# EAGLE design breakout (EAGLE 6.2)
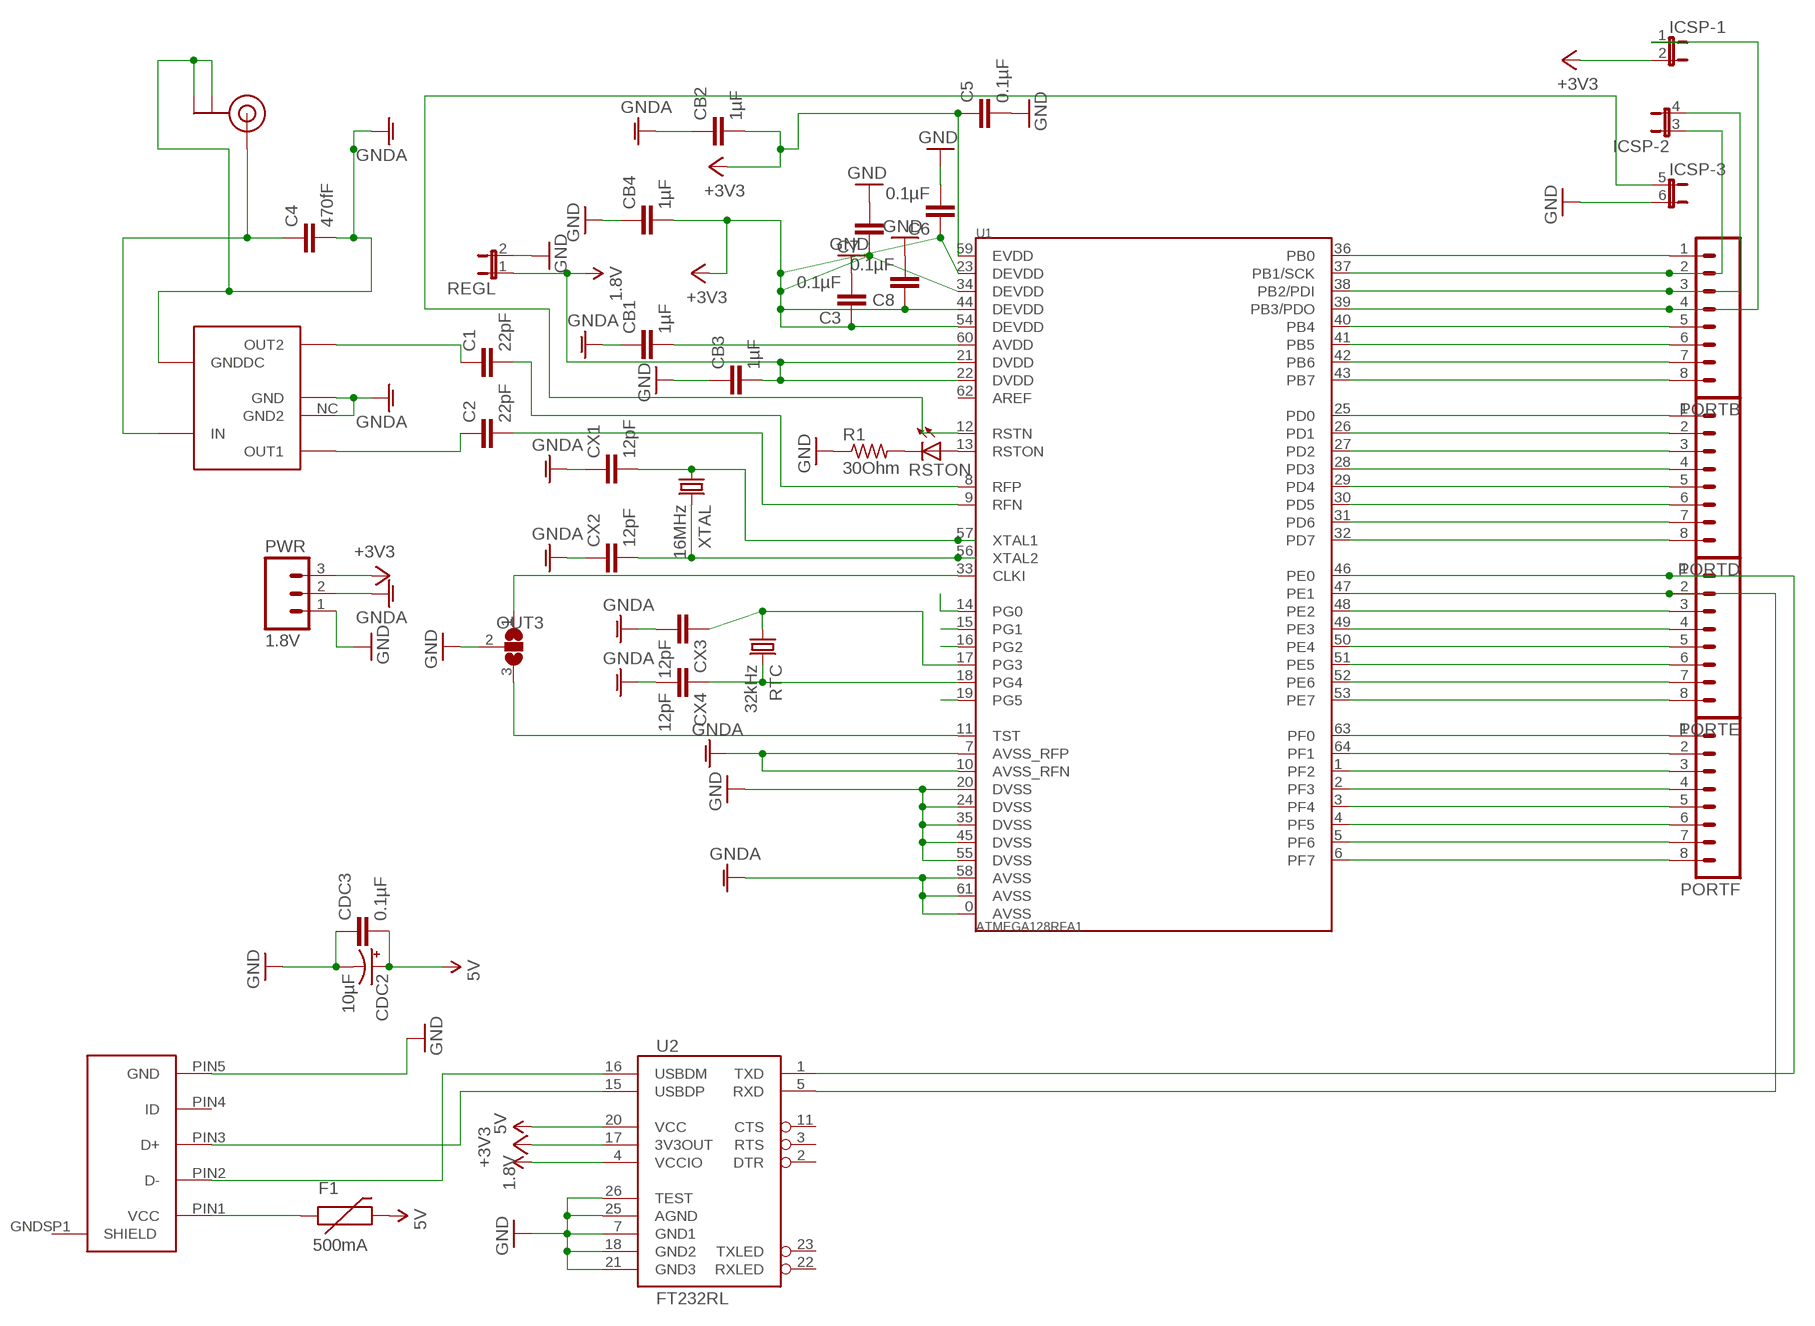
[diagram p0: schematic, sheet 1]

## Parts
B1  2.4GHz  WE-BAL  [WE-BAL]
C1  22pF  C-EUC0603  [C0603]
C2  22pF  C-EUC0603  [C0603]
C3  0.1µF  C-EUC0201  [C0201]
C4  470fF  C-EUC0402  [C0402]
C5  0.1µF  C-EUC0201  [C0201]
C6  0.1µF  C-EUC0201  [C0201]
C7  C-EUC0201  [C0201]
C8  0.1µF  C-EUC0201  [C0201]
CB1  1µF  C-EUC0603  [C0603]
CB2  1µF  C-EUC0603  [C0603]
CB3  1µF  C-EUC0603  [C0603]
CB4  1µF  C-EUC0603  [C0603]
CDC2  10µF  CAP_POL1206  [EIA3216]
CDC3  0.1µF  C-EUC0201  [C0201]
CX1  12pF  C-EUC0603  [C0603]
CX2  12pF  C-EUC0603  [C0603]
CX3  12pF  C-EUC0603  [C0603]
CX4  12pF  C-EUC0603  [C0603]
F1  500mA  PTC0603  [0603]
ICSP  JP3QE  [JP3Q]
JP1  USBMICROB  [MICROB]
OUT3  SOLDERJUMPERNO  SJ2W  [SJ_2]
PORTB  M081X08  [1X08]
PORTD  M081X08  [1X08]
PORTE  M081X08  [1X08]
PORTF  M081X08  [1X08]
PWR  1.8V  M03PTH  [1X03]
R1  30Ohm  R-US_R0603  [R0603]
REGL  JP1E  [JP1]
RSTON  LEDCHIPLED_0603  [CHIPLED_0603]
RTC  32kHz  CRYSTALTC26H  [TC26H]
U1  ATMEGA128RFA1  [QFN-64]
U2  FT232RL  FT232RL-BASICSSOP  [SSOP28DB]
U$6  U.FL  [U.FL]
XTAL  16MHz  CRYSTALHC49UP  [HC49UP]

## Nets
1.8V: CB3.2 REGL.1 U1.21(DVDD) U1.22(DVDD) U2.4(VCCIO)
5V: CDC2.A(+) CDC3.2 F1.2 U2.20(VCC)
+3V3: C3.1 C5.1 C6.1 C7.1 C8.1 CB2.2 CB4.2 ICSP.2 PWR.3 U1.23(DEVDD) U1.34(DEVDD) U1.44(DEVDD) U1.54(DEVDD) U1.59(EVDD) U2.17(3V3OUT)
GND: C3.2 C5.2 C6.2 C7.2 C8.2 CB3.1 CB4.1 CDC2.C(-) CDC3.1 ICSP.6 JP1.PIN5(GND) OUT3.2 PWR.1 R1.1 REGL.2 U1.20(DVSS) U1.24(DVSS) U1.35(DVSS) U1.45(DVSS) U1.55(DVSS) U2.7(GND1) U2.18(GND2) U2.21(GND3) U2.25(AGND) U2.26(TEST)
GNDA: B1.GND B1.GNDDC B1.NC(GND2) C4.2 CB1.1 CB2.1 CX1.1 CX2.1 CX3.2 CX4.2 PWR.2 U1.0(AVSS) U1.7(AVSS_RFP) U1.10(AVSS_RFN) U1.58(AVSS) U1.61(AVSS) U$6.P$1(GND) U$6.P$2(GND)
N$1: CX3.1 RTC.1 U1.17(PG3)
N$2: CX4.1 RTC.2 U1.18(PG4)
N$3: ICSP.1 PORTB.4 U1.39(PB3/PDO)
N$4: CB1.2 U1.60(AVDD)
N$5: B1.OUT1 C2.1
N$6: ICSP.3 PORTB.2 U1.37(PB1/SCK)
N$7: OUT3.1 U1.33(CLKI)
N$8: PORTD.1 U1.25(PD0)
N$9: C2.2 U1.9(RFN)
N$10: CX2.2 U1.56(XTAL2) XTAL.2
N$11: PORTD.2 U1.26(PD1)
N$12: ICSP.5 U1.12(RSTN)
N$13: CX1.2 U1.57(XTAL1) XTAL.1
N$14: C1.2 U1.8(RFP)
N$15: B1.OUT2 C1.1
N$17: U1.14(PG0)
N$18: PORTD.3 U1.27(PD2)
N$19: PORTD.4 U1.28(PD3)
N$20: JP1.PIN3(D+) U2.15(USBDP)
N$21: PORTD.5 U1.29(PD4)
N$22: PORTD.6 U1.30(PD5)
N$23: PORTD.7 U1.31(PD6)
N$24: PORTD.8 U1.32(PD7)
N$25: PORTE.1 U1.46(PE0) U2.1(TXD)
N$26: PORTE.2 U1.47(PE1) U2.5(RXD)
N$27: PORTE.3 U1.48(PE2)
N$28: PORTE.4 U1.49(PE3)
N$29: PORTE.5 U1.50(PE4)
N$30: PORTE.6 U1.51(PE5)
N$31: PORTE.7 U1.52(PE6)
N$32: PORTE.8 U1.53(PE7)
N$33: PORTF.1 U1.63(PF0)
N$34: PORTF.2 U1.64(PF1)
N$35: PORTF.3 U1.1(PF2)
N$36: PORTF.4 U1.2(PF3)
N$37: U1.15(PG1)
N$38: U1.16(PG2)
N$39: U1.19(PG5)
N$41: PORTB.1 U1.36(PB0)
N$42: PORTB.5 U1.40(PB4)
N$43: PORTB.6 U1.41(PB5)
N$44: PORTB.7 U1.42(PB6)
N$45: PORTB.8 U1.43(PB7)
N$46: OUT3.3 U1.11(TST)
N$47: JP1.PIN2(D-) U2.16(USBDM)
N$48: F1.1 JP1.PIN1(VCC)
N$50: RSTON.A U1.13(RSTON)
N$51: R1.2 RSTON.C
N$55: ICSP.4 PORTB.3 U1.38(PB2/PDI)
SMA: B1.IN C4.1 U$6.P$3(SIGNAL)
TCK: PORTF.5 U1.3(PF4)
TDI: PORTF.8 U1.6(PF7)
TDO: PORTF.7 U1.5(PF6)
TMS: PORTF.6 U1.4(PF5)
Unconnected: JP1.GNDSP1(SHIELD) JP1.PIN4(ID) U1.62(AREF) U2.2(DTR) U2.3(RTS) U2.11(CTS) U2.22(RXLED) U2.23(TXLED)

## Library data of the parts
B1 = matt-custom:WE-BAL
C1-C8 CB1-CB4 CDC3 CX1-CX4 = rcl:C-EU: CAPACITOR, European symbol
CDC2 = SparkFun:CAP_POL: Capacitor Polarized These are standard SMD and PTH capacitors. Normally 10uF, 47uF, and 100uF in electrolytic and tantalum varieties. Always verify the external diameter of the through hole cap, it varies with capacity, voltage, and manufacturer. The EIA devices should be standard.
F1 = SparkFun:PTC: Resettable Fuse PTC Resettable Fuse. Spark Fun Electronics SKU : COM-08357
ICSP = jumper:JP3QE: JUMPER
JP1 = matt-custom:USBMICROB
OUT3 = jumper:SJ2W: SMD solder JUMPER
PORTB PORTD PORTE PORTF = SparkFun:M08: Header 8 Standard 8-pin 0.1" header. Use with straight break away headers (SKU : PRT-00116), right angle break away headers (PRT-00553), swiss pins (PRT-00743), machine pins (PRT-00117), and female headers (PRT-00115).
PWR = SparkFun:M03: Header 3 Standard 3-pin 0.1" header. Use with straight break away headers (SKU : PRT-00116), right angle break away headers (PRT-00553), swiss pins (PRT-00743), machine pins (PRT-00117), and female headers (PRT-00115). Molex polarized connector foot print use with SKU : PRT-08232 with associated crimp pins and housings.
R1 = rcl:R-US_: RESISTOR, American symbol
REGL = jumper:JP1E: JUMPER
RSTON = led:LED: LED OSRAM: - CHIPLED LG R971, LG N971, LY N971, LG Q971, LY Q971, LO R971, LY R971 LH N974, LH R974 LS Q976, LO Q976, LY Q976 LO Q996 - Hyper CHIPLED LW Q18S LB Q993, LB Q99A, LB R99A - SideLED LS A670, LO A670, LY A670, LG A670, LP A670 LB A673, LV A673, LT A673, LW A673 LH A674 LY A675 LS A676, LA A676, LO A676, LY A676, LW A676 LS A679, LY A679, LG A679 - Hyper Micro SIDELED® LS Y876, LA Y876, LO Y876, LY Y876 LT Y87S - SmartLED LW L88C, LW L88S LB L89C, LB L89S, LG L890 LS L89K, LO L89K, LY L89K LS L896, LA L896, LO L896, LY L896 - TOPLED LS T670, LO T670, LY T670, LG T670, LP T670 LSG T670, LSP T670, LSY T670, LOP T670, LYG T670 LG T671, LOG T671, LSG T671 LB T673, LV T673, LT T673, LW T673 LH T674 LS T676, LA T676, LO T676, LY T676, LB T676, LH T676, LSB T676, LW T676 LB T67C, LV T67C, LT T67C, LS T67K, LO T67K, LY T67K, LW E67C LS E67B, LA E67B, LO E67B, LY E67B, LB E67C, LV E67C, LT E67C LW T67C LS T679, LY T679, LG T679 LS T770, LO T770, LY T770, LG T770, LP T770 LB T773, LV T773, LT T773, LW T773 LH T774 LS E675, LA E675, LY E675, LS T675 LS T776, LA T776, LO T776, LY T776, LB T776 LHGB T686 LT T68C, LB T68C - Hyper Mini TOPLED® LB M676 - Mini TOPLED Santana® LG M470 LS M47K, LO M47K, LY M47K Source: http://www.osram.convergy.de LUXEON: - LUMILED® LXK2-PW12-R00, LXK2-PW12-S00, LXK2-PW14-U00, LXK2-PW14-V00 LXK2-PM12-R00, LXK2-PM12-S00, LXK2-PM14-U00 LXK2-PE12-Q00, LXK2-PE12-R00, LXK2-PE12-S00, LXK2-PE14-T00, LXK2-PE14-U00 LXK2-PB12-K00, LXK2-PB12-L00, LXK2-PB12-M00, LXK2-PB14-N00, LXK2-PB14-P00, LXK2-PB14-Q00 LXK2-PR12-L00, LXK2-PR12-M00, LXK2-PR14-Q00, LXK2-PR14-R00 LXK2-PD12-Q00, LXK2-PD12-R00, LXK2-PD12-S00 LXK2-PH12-R00, LXK2-PH12-S00 LXK2-PL12-P00, LXK2-PL12-Q00, LXK2-PL12-R00 Source: www.luxeon.com KINGBRIGHT: KA-3528ASYC Source: www.kingbright.com
RTC XTAL = crystal:CRYSTAL: CRYSTAL; OC_FARNELL: unknown; OC_NEWARK: unknown
U1 = matt-custom:ATMEGA128RFA1
U2 = SparkFun:FT232RL-BASIC: USB UART This is the simplified version of the FT232RL unit. Only what you need, nothing you don't. Spark Fun Electronics SKU : COM-00650
U$6 = SparkFun-Connectors:U.FL: SMD antenna connector- WRL-09144

## Board
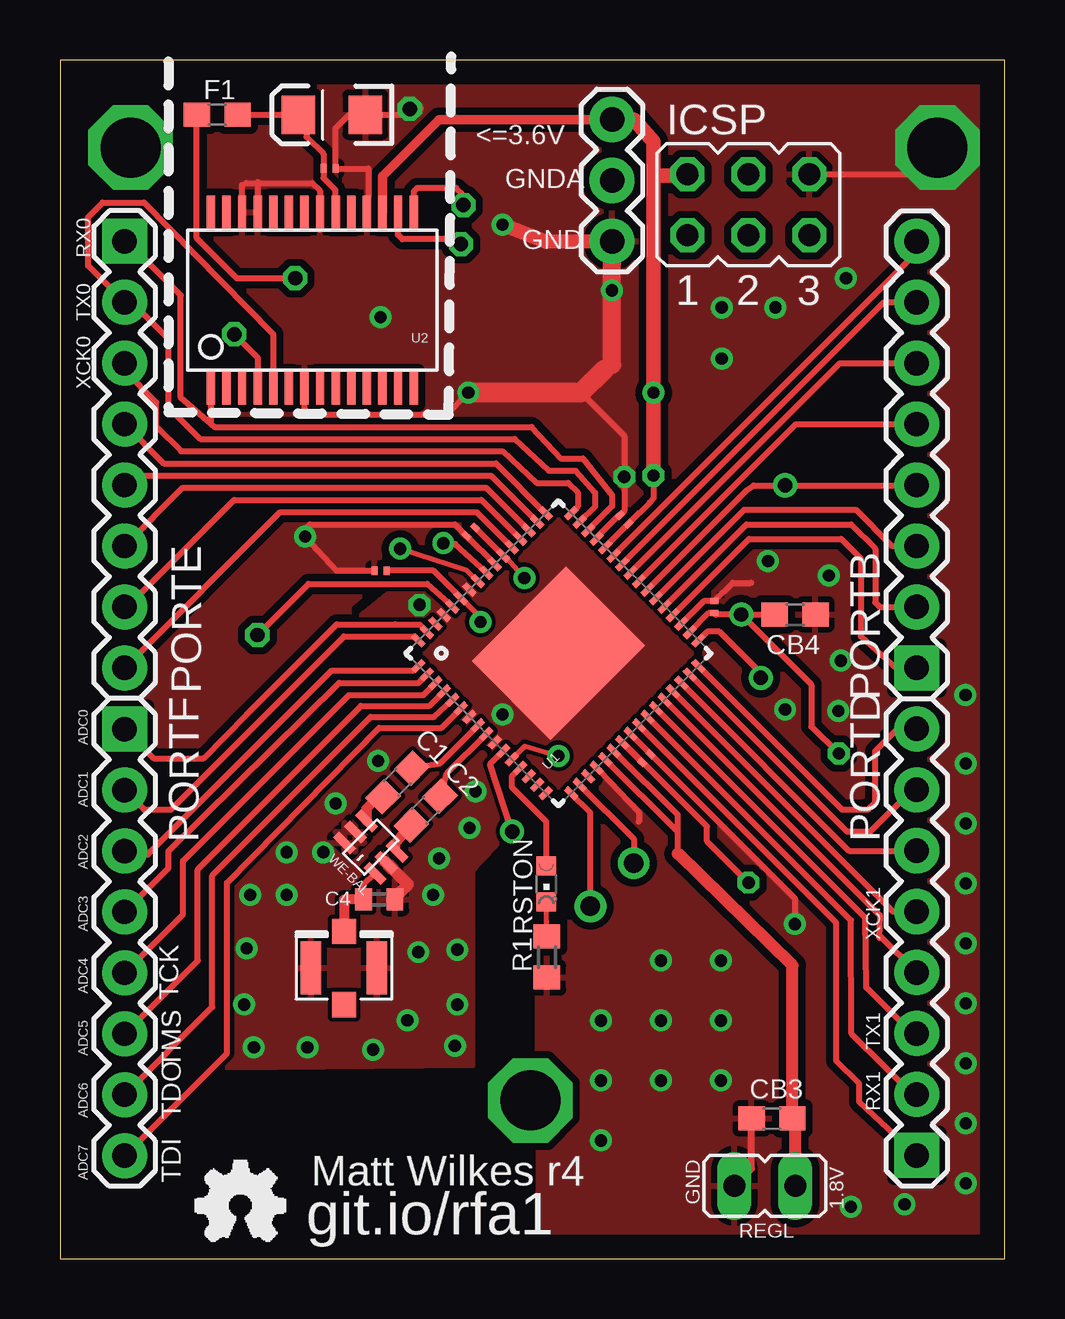
[diagram p1: board, top side]
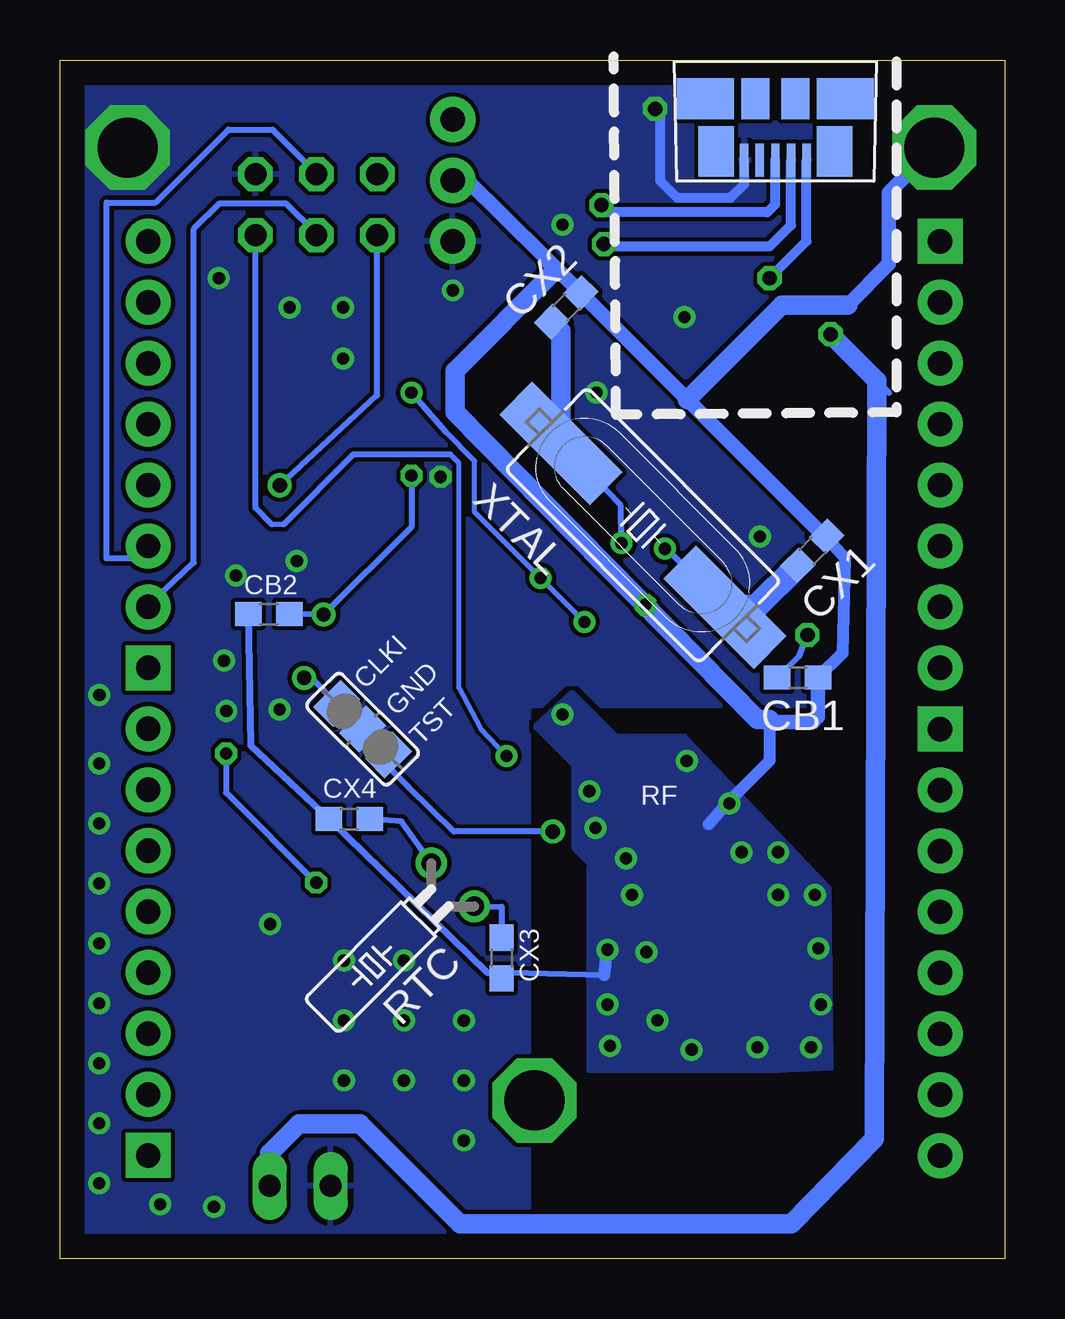
[diagram p2: board, bottom side, seen from below]

Size 39.39 x 49.98 mm. Coordinates in mm from the lower left corner, seen from the top.
Outline: 0,0 39.39,0 39.39,49.98 0,49.98 0,0
Copper layers (1*16): Top 0.035mm / dielectric 1.5mm / Bottom 0.035mm
Design rules: minimum track width 7mil, minimum drill 15mil, track to track 7mil, track to pad 8mil, pad to pad 8mil, via to via 8mil, smd to smd 8mil, copper to edge 40mil, drill to drill 10mil, minimum pad ring 10mil, minimum via ring 8mil, stop-mask expansion 0mil, vias tented up to drill 0mil, thermal gap 10mil

### Footprints (pad centres in the part's own frame; a part is rotated, then mirrored left to right if it is on the bottom)
WE-BAL = smd 1 x 0.35: GND 0.9,0; GNDDC -0.9,0; IN -0.9,0.65; NC 0.9,0.65; OUT1 -0.9,-0.65; OUT2 0.9,-0.65
C0603 = smd 1.1 x 1: 1 -0.85,0; 2 0.85,0
C0201 = smd 0.25 x 0.35: 1 -0.25,0; 2 0.25,0
C0402 = smd 0.7 x 0.9: 1 -0.65,0; 2 0.65,0
EIA3216 = smd 1.4 x 1.6: A 1.4,0; C -1.4,0
0603 = smd 1.1 x 1: 1 -0.85,0; 2 0.85,0
JP3Q = drill 0.914 octagon: 1 -2.54,-1.27; 2 -2.54,1.27; 3 0,-1.27; 4 0,1.27; 5 2.54,-1.27; 6 2.54,1.27
MICROB = smd 2.1 x 1.475: GNDFP1 3.25,1.638; GNDFP2 3.25,6.563 | smd 1.7 x 1.175: GNDSP1 1.05,3.263; GNDSP4 1.05,4.938 | smd 1.7 x 2.375: GNDSP2 1.05,7.013; GNDSP3 1.05,1.188 | smd 1.38 x 0.35: PIN1 3.61,5.4; PIN2 3.61,4.75; PIN3 3.61,4.1; PIN4 3.61,3.45; PIN5 3.61,2.8
SJ_2 = smd 1.168 x 1.6: 1 -1.524,0; 2 0,0; 3 1.524,0
1X08 = drill 1.016 pad 1.88 square: 1 0,0 | drill 1.016 pad 1.88: 2 2.54,0; 3 5.08,0; 4 7.62,0; 5 10.16,0; 6 12.7,0; 7 15.24,0; 8 17.78,0
1X03 = drill 1.016 pad 1.88: 1 0,0; 2 2.54,0; 3 5.08,0
R0603 = smd 1 x 1.1: 1 -0.85,0; 2 0.85,0
JP1 = drill 0.914 long: 1 0,-1.27; 2 0,1.27
CHIPLED_0603 = smd 0.8 x 0.8: A 0,-0.75; C 0,0.75
TC26H = drill 0.813: 1 -1.27,0; 2 1.27,0
QFN-64 = smd 5.563 x 4.648: 0 0,0 | smd 0.6 x 0.25: 1 -4.5,3.75; 2 -4.5,3.25; 3 -4.5,2.75; 4 -4.5,2.25; 5 -4.5,1.75; 6 -4.5,1.25; 7 -4.5,0.75; 8 -4.5,0.25; 9 -4.5,-0.25; 10 -4.5,-0.75; 11 -4.5,-1.25; 12 -4.5,-1.75; 13 -4.5,-2.25; 14 -4.5,-2.75; 15 -4.5,-3.25; 16 -4.5,-3.75; 33 4.5,-3.75; 34 4.5,-3.25; 35 4.5,-2.75; 36 4.5,-2.25; 37 4.5,-1.75; 38 4.5,-1.25; 39 4.5,-0.75; 40 4.5,-0.25; 41 4.5,0.25; 42 4.5,0.75; 43 4.5,1.25; 44 4.5,1.75; 45 4.5,2.25; 46 4.5,2.75; 47 4.5,3.25; 48 4.5,3.75 | smd 0.25 x 0.6: 17 -3.75,-4.5; 18 -3.25,-4.5; 19 -2.75,-4.5; 20 -2.25,-4.5; 21 -1.75,-4.5; 22 -1.25,-4.5; 23 -0.75,-4.5; 24 -0.25,-4.5; 25 0.25,-4.5; 26 0.75,-4.5; 27 1.25,-4.5; 28 1.75,-4.5; 29 2.25,-4.5; 30 2.75,-4.5; 31 3.25,-4.5; 32 3.75,-4.5; 49 3.75,4.5; 50 3.25,4.5; 51 2.75,4.5; 52 2.25,4.5; 53 1.75,4.5; 54 1.25,4.5; 55 0.75,4.5; 56 0.25,4.5; 57 -0.25,4.5; 58 -0.75,4.5; 59 -1.25,4.5; 60 -1.75,4.5; 61 -2.25,4.5; 62 -2.75,4.5; 63 -3.25,4.5; 64 -3.75,4.5
SSOP28DB = smd 0.348 x 1.397: 1 -4.225,-3.656; 2 -3.575,-3.656; 3 -2.925,-3.656; 4 -2.275,-3.656; 5 -1.625,-3.656; 6 -0.975,-3.656; 7 -0.325,-3.656; 8 0.325,-3.656; 9 0.975,-3.656; 10 1.625,-3.656; 11 2.275,-3.656; 12 2.925,-3.656; 13 3.575,-3.656; 14 4.225,-3.656; 15 4.225,3.656; 16 3.575,3.656; 17 2.925,3.656; 18 2.275,3.656; 19 1.625,3.656; 20 0.975,3.656; 21 0.325,3.656; 22 -0.325,3.656; 23 -0.975,3.656; 24 -1.625,3.656; 25 -2.275,3.656; 26 -2.925,3.656; 27 -3.575,3.656; 28 -4.225,3.656
U.FL = smd 2.2 x 0.85: P$1 0,1.375; P$2 0,-1.375 | smd 1.05 x 1: P$3 1.525,0; P$4 -1.525,0
HC49UP = smd 5.334 x 1.93: 1 -4.826,0; 2 4.826,0

### Placement (x,y rotation side)
B1  12.95,17.17 135 top
C1  14.07,19.86 45 top
C2  15.24,18.69 45 top
C3  13.36,28.69 180 top
C4  13.31,14.99 0 top
C5  24.44,20.87 45 top
C6  27.28,27.17 90 top
C7  23.52,30.82 135 top
C8  17.12,30.32 225 top
CB1  8.64,24.23 180 bottom
CB2  30.68,26.87 0 bottom
CB3  29.68,5.85 0 top
CB4  30.65,26.86 180 top
CDC2  11.33,47.69 180 top
CDC3  11.23,45.45 180 top
CX1  8.03,29.51 225 bottom
CX2  18.29,39.67 225 bottom
CX3  20.98,12.55 270 bottom
CX4  27.33,18.34 180 bottom
F1  6.56,47.69 0 top
ICSP  28.7,43.94 0 top
JP1  13.67,49.42 270 bottom
OUT3  26.77,22.09 315 bottom
PORTB  35.72,24.64 90 top
PORTD  35.72,4.32 90 top
PORTE  2.7,42.42 270 top
PORTF  2.7,22.09 270 top
PWR  23.02,42.42 90 top
R1  20.3,12.59 90 top
REGL  29.38,3.04 90 top
RSTON  20.27,15.63 180 top
RTC  23.01,15.6 135 bottom
U1  20.78,25.25 45 top
U2  10.52,39.97 0 top
U$6  11.84,12.13 90 top
XTAL  15.09,30.58 135 bottom

### Tracks (layer width: path | path; a pad name or v marks a point on that pad's centre or on a via)
1.8V  (via drill 0.6)
  Top 0.254: U2.4 8.24,37.57 v7.27,38.54 | U1.22 25.76,18.5 25.76,17.79 | 25.76,17.79 U1.21 | 25.76,16.9 25.76,17.79
  Top 0.508: 25.76,16.9 30.53,12.23 CB3.2 30.65,5.54 REGL.1
  Bottom 0.254: v7.27,38.54 4.83,36.11
  Bottom 0.813: REGL.1 30.65,4.39 29.42,5.63 26.88,5.63 22.71,1.46 8.89,1.46 5.44,5.02 5.34,36.61 v7.27,38.54
5V
  Top 0.254: U2.20 11.47,44.36 11.47,44.57 10.98,45.06 CDC3.2 10.98,46.06 10.28,46.76 10.28,47.34 CDC2.A F1.2
+3V3  (via drill 0.51, 0.6)
  Top 0.203: U1.59 17.53,26.73 v17.53,26.56 | 18.65,29.2 v19.36,28.38 19.41,28.38
  Top 0.254: U1.59 15.57,28.69 C3.1 | C8.1 U1.54 18.59,29.2 18.65,29.2 | C5.1 24.26,20.7 U1.23 23.46,21.53 26.98,18.02 26.98,17.41 v28.7,15.68 | U1.34 27.04,26.92 C6.1 27.34,26.86 v28.4,26.86 | v28.4,26.86 CB4.2 | v24.74,32.65 24.74,31.74 24.59,31.53 C7.1 U1.44 24.16,31.1 | v32.46,21.07 31.32,22.19 31.32,23.95 v28.4,26.86 | ICSP.2
  Top 0.406: U2.17 13.44,45.13 15.8,47.49 18.22,47.49 PWR.3
  Top 0.61: 24.74,45.15 v24.74,36.11 v24.74,32.65 | 24.74,45.15 24.74,46.57 24.03,47.38 23.92,47.5 PWR.3 | ICSP.2 26.1,45.15 24.74,45.15
  Bottom 0.203: v17.53,26.56 v19.36,28.38 | v19.36,28.38 19.41,28.38 | v19.36,28.38 22.1,31.13 22.1,33.26 23.32,34.49 23.33,34.48
  Bottom 0.254: CB2.2 29.71,26.87 v28.4,26.86 24.74,30.52 v24.74,32.65 | v32.46,21.07 32.46,19.44 v28.7,15.68 | 23.32,34.49 v24.74,36.11
GND  (via drill 0.51, 0.6, 2.5)
  Top 0.254: U1.20 22.49,20.37 24.13,18.63 24.13,18.22 | v36.58,46.33 35.46,45.21 ICSP.6 | 23.01,41.49 22.91,41.39 | 10.84,42.89 U2.21 10.84,44.52 10.52,44.84 8.18,44.84 | U2.26 7.59,44.76 7.78,44.84 8.18,44.84 | U2.25 8.24,44.88 8.18,44.84 | U2.7 10.19,35.42 10.42,35.19 16.11,35.19 v17.02,36.11 | 22.69,37.08 23.01,37.26 | CDC2.C 12.86,47.69 | U1.45 22.37,30.07 23.29,31 C7.2 23.52,31.18 v23.52,32.6 23.52,34.3 21.72,36.11 | C3.2 11.53,28.69 v10.21,30.11 10.21,30.42 10.42,30.62 16.47,30.62 C8.2 U1.55 | U1.35 26.83,27.42 C6.2 28.05,28.18 28.81,28.18 | C5.2 U1.24 30.64,15.04 v30.64,13.96 | U2.18 12.79,44.14 12.86,44.34 12.86,45.45 CDC3.1 | CDC2.C 12.04,47.69 11.48,47.13 CDC3.1 | CDC2.C 14.73,47.69 15,47.95 15.05,47.95 v14.58,47.94 | CDC3.1 11.48,45.41
  Top 0.3: CB3.1 28.83,3.77 REGL.2
  Top 0.61: v18.44,43.12 20.27,42.41 PWR.1
  Top 0.75: 23.01,37.26 23.01,41.49 PWR.1
  Top 0.813: v17.02,36.11 21.72,36.11 22.69,37.08
  Bottom 0.406: JP1.PIN5 10.87,44.8 11.43,44.23 13.67,44.23 14.38,44.95 14.38,47.74 v14.58,47.94
  other vias: 22.55,9.94 22.55,7.44 22.55,4.94 25.05,12.44 25.05,9.94 25.05,7.44 27.55,12.44 27.55,9.94 27.55,7.44 37.76,20.65 37.76,18.15 37.76,15.65 37.76,13.15 37.76,10.65 37.76,8.15 37.76,5.65 37.76,3.15 32.45,22.84 32.55,24.94 35.21,2.27 30.23,22.9 32.06,28.49 29.52,29.1 32.97,2.17 37.75,23.51 23.02,40.37 27.59,37.53 27.59,39.66 29.82,39.66 32.77,40.88 13.36,39.26
  pour Top (isolate 0.305, rank 5): 19.97,0.04 21.49,-0.06 39.27,0.04 39.37,49.82 0,50.03 0.1,19.44 0.05,9.49 8.69,9.49 19.87,16.6
  pour Bottom (rank 3): 0.05,49.92 39.27,49.9 39.37,0.04 19.87,-0.16 19.87,23.1 0.05,23.1
GNDA  (via drill 0.51, 2.5)
  Top 0.508: B1.GNDDC 14.51,15.61 13.96,15.06 C4.2
  Bottom 0.254: 16.69,11.82 20.68,11.93
  Bottom 0.3: CX3.2 21.01,11.8 20.68,11.93 21.56,11.93 CX4.2 31.43,21.39 CB2.1 | 7.53,30.12 CX1.1
  Bottom 0.508: 12.35,18.12 11.64,18.94 9.81,20.76 9.81,22.39 | 16.69,11.82 16.59,12.86 | 7.47,30.11 6.66,29.2 6.76,25.26 CB1.1
  Bottom 0.61: CB1.1 7.79,22.58 7.98,22.39 9.81,22.39 9.81,22.49 | 7.53,30.12 13.24,35.83 CX2.1 19.25,41.84 | 18.75,41.19 19.25,41.84 | 6.56,39.76 4.83,41.49 4.83,44.44 v2.94,46.33 | PWR.2 22.44,44.99 19.25,41.84
  Bottom 0.813: 18.75,41.19 22.91,37.02 22.91,35.29 10.32,22.49 9.81,22.49 | 6.56,39.76 9.3,39.76 13.24,35.83
  other vias: 13.26,20.76 17.33,19.49 17.07,17.97 15.8,16.7 11.48,18.99 10.98,16.95 9.45,16.95 7.93,15.18 9.45,15.18 15.55,15.18 16.56,12.89 16.56,10.6 16.46,8.88 7.78,12.94 7.67,10.6 8.08,8.83 10.32,8.83 13.06,8.73 14.48,9.94 14.94,12.79 18.44,22.7 14.99,27.27
  pour Top (no thermals): 19.76,32.65 12.35,26.66 20.88,18.83 27.59,25.84 20.58,33.57 19.66,32.65
  pour Top: 16,24.52 7.06,15.79 6.96,7.96 17.22,8.06 17.22,16.19 21.08,20.36 16.11,24.52
  pour Bottom: 18.04,23.61 16.21,21.78 13.36,21.78 7.37,15.48 7.27,7.96 9.5,7.86 17.33,7.86 17.33,16.29 17.12,16.29 17.94,17.11 17.94,20.56 19.56,22.19
N$1
  Top 0.254: U1.17 22.11,18.61 RTC.1
  Bottom 0.254: RTC.1 20.98,14.68 CX3.1
N$2
  Top 0.254: U1.18 23.92,17.51 RTC.2
  Bottom 0.254: RTC.2 25.15,18.24 CX4.1
N$3  (via drill 0.6)
  Top 0.254: U1.39 28.63,32.04 28.91,32.25 v30.23,32.25 35,32.25 35.02,32.26 PORTB.4
  Bottom 0.254: ICSP.1 26.16,36.01 v30.23,32.25
N$4  (via drill 0.6)
  Top 0.254: U1.60 15.3,28.14 10.36,28.14 v8.23,26.01
  Bottom 0.254: v8.23,26.01 8.57,25.13 CB1.2
N$5
  Top 0.254: B1.OUT1
  Top 0.3: B1.OUT1 14.05,17.4
  Top 0.406: 14.05,17.4 C2.1
N$6
  Top 0.254: U1.37 28.62,30.62 32.97,30.62 33.99,29.6 33.99,27.37 34.18,27.18 PORTB.2
  Bottom 0.254: ICSP.3 28.7,42.73 29.97,44.01 32.74,44.01 33.81,42.94 33.81,29.02 35.81,27.13 35.77,27.13 PORTB.2
N$7  (via drill 0.6)
  Top 0.254: U1.33 26.98,26.15 27.49,26.15 29.21,24.42 v29.21,24.22 29.21,24.12
  Bottom 0.254: 29.11,24.22 v29.21,24.22 28.91,24.22 OUT3.1
N$8
  Top 0.254: U1.25 32.36,14.02 32.36,8.27 33.32,7.31 33.32,6.55 PORTD.1
N$9
  Top 0.254: U1.9 16.14,20.26 C2.2
N$10  (via drill 0.51)
  Top 0.254: U1.56 16.47,29.81 v15.98,29.83
  Bottom 0.254: XTAL.2 16,31.4 v15.98,29.83
  Bottom 0.75: 18.5,38.68 CX2.2
  Bottom 0.813: XTAL.2 18.5,38.68
N$11
  Top 0.254: U1.26 32.97,14.11 33,9.39 35.72,6.69 PORTD.2
N$12  (via drill 0.51)
  Top 0.203: U1.12 19.38,21.37 v20.78,20.97
  Bottom 0.203: v20.78,20.97 21.85,22.09 22.76,23.81 22.76,33.18 23.12,33.53 | 30.08,30.62 30.56,30.62
  Bottom 0.254: 23.12,33.53 27.16,33.53 30.08,30.62 | ICSP.5 31.24,31.3 30.56,30.62
N$13  (via drill 0.51)
  Top 0.203: U1.57 16.94,28.71 v14.18,29.6
  Bottom 0.254: XTAL.1 13.91,29.4 v14.18,29.6
  Bottom 1.016: CX1.2 10.37,27.17 XTAL.1
N$14
  Top 0.254: U1.8 15.84,20.66 C1.2
N$15
  Top 0.406: C1.1 13.23,19.23 12.78,18.77 B1.OUT2
N$16
  pour Bottom (isolate 0.61): 7.06,48.3 12.35,48.3 12.35,46.06 7.17,46.06 7.17,48.2
N$18
  Top 0.254: U1.27 33.58,14.21 33.61,11.32 35.06,9.89 PORTD.3
N$19
  Top 0.254: U1.28 34.19,14.31 34.17,13.37 34.17,13.47 PORTD.4
N$20  (via drill 0.6)
  Top 0.254: U2.15 14.74,44.5 14.89,44.64 16.51,44.64 16.82,44.34 v16.82,43.93
  Bottom 0.254: v16.82,43.93 16.51,43.93
  Bottom 0.406: JP1.PIN3 9.57,43.97 9.91,43.62 16.51,43.62 v16.82,43.93
N$21
  Top 0.254: U1.29 34.73,14.48 PORTD.5
N$22
  Top 0.254: U1.30 32.9,17.02 PORTD.6
N$23
  Top 0.254: U1.31 32.8,17.82 33.78,17.82 35.52,19.56 PORTD.7
N$24
  Top 0.254: U1.32 32.6,18.73 33.68,18.73 33.99,19.04 33.99,21.17 34.91,22.1 PORTD.8
N$25
  Top 0.254: U1.46 23.02,31.37 23.02,31.84 21.8,33.36 20.88,33.36 19.66,34.68 6.45,34.68 6.31,34.79 | 6.31,34.79 5.03,35.9 5.03,40.17 2.78,42.42 PORTE.1 | U2.1 6.29,34.81 6.31,34.79
N$26
  Top 0.254: U1.47 22.3,31.37 22.3,31.94 21.49,32.85 20.37,32.85 18.95,34.18 5.84,34.18 4.52,35.5 4.52,38.34 2.99,39.88 PORTE.2 1.17,41.4 1.17,43.42 1.78,44.03 3.51,44.03 8.89,38.54 U2.5
N$27
  Top 0.254: U1.48 21.59,31.37 21.59,31.94 21.19,32.35 19.87,32.35 18.44,33.67 5.04,33.67 4.02,34.7 4.02,35.7 2.7,37.02 PORTE.3
N$28
  Top 0.254: U1.49 18.17,33.16 4.33,33.16 PORTE.4
N$29
  Top 0.254: U1.50 17.97,32.65 6.86,32.65 6.25,32.65 3.09,32.65 PORTE.5
N$30
  Top 0.254: U1.51 17.77,32.14 5.12,32.14 PORTE.6
N$31
  Top 0.254: U1.52 17.57,31.64 7.27,31.64 2.81,27.18 PORTE.7
N$32
  Top 0.254: U1.53 17.37,31.13 9.19,31.13 PORTE.8
N$33
  Top 0.254: U1.63 15.01,26.44 13.97,26.45 11.53,26.45 7.78,22.69 5.98,20.87 3.91,20.87 PORTF.1
N$34
  Top 0.254: U1.64 14.77,25.95 11.84,25.95 4.63,18.73 3.51,18.73 PORTF.2
N$35
  Top 0.254: U1.1 14.73,24.52 11.33,24.52 3.66,16.85 2.85,16.85 PORTF.3
N$36
  Top 0.254: U1.2 14.95,24.02 11.64,24.02 4.52,17.01 4.52,16.29 PORTF.4
N$41
  Top 0.254: U1.36 28.72,30.01 32.57,30.01 33.38,29.2 33.38,25.95 35.35,24.18 PORTB.1
N$42
  Top 0.254: U1.40 30.68,34.8 PORTB.5
N$43
  Top 0.254: U1.41 32.51,37.34 PORTB.6
N$44
  Top 0.254: U1.42 34.35,39.88 PORTB.7
N$45
  Top 0.254: U1.43 35.55,41.79 PORTB.8
N$46  (via drill 0.6)
  Top 0.254: U1.11 17.94,20.64 v18.85,17.82
  Bottom 0.254: v18.85,17.82 22.96,17.82 24.84,19.65 25.7,20.5 OUT3.3
N$47  (via drill 0.6)
  Top 0.254: U2.16 14.09,42.69 14.28,42.51 16.41,42.51 v16.72,42.3
  Bottom 0.254: v16.72,42.3 16.41,42.2
  Bottom 0.406: JP1.PIN2 8.92,43.09 9.81,42.2 16.61,42.2 v16.72,42.3
N$48  (via drill 0.6)
  Top 0.254: F1.1 5.71,42.54 7.37,40.88 v9.81,40.88
  Bottom 0.406: JP1.PIN1 8.27,42.42 v9.81,40.88
N$50
  Top 0.254: U1.13 18.85,20.14 18.85,19.65 20.27,18.22 RSTON.A
N$51
  Top 0.203: R1.2 20.28,14.06 RSTON.C
N$52  (via drill 2.5)
  other vias: 19.61,6.6
N$55
  Top 0.254: U1.38 28.53,31.23 33.18,31.23 34.69,29.72 PORTB.3
  Bottom 0.254: ICSP.4 28.7,45.25 30.53,47.08 32.36,47.08 35.41,44.03 37.44,44.03 37.44,29.2 35.55,29.2 PORTB.3
SMA
  Top 0.254: B1.IN 12.66,15.6 C4.1
  Top 0.406: C4.1 11.84,14.99 U$6.P$3
TCK
  Top 0.254: U1.3 15.15,23.51 12.04,23.51 5.13,16.6 5.13,14.36 PORTF.5
TDI
  Top 0.254: U1.6 15.9,22.14 13.31,22.14 6.96,15.68 6.96,8.57 PORTF.8
TDO
  Top 0.254: U1.5 15.6,22.59 12.96,22.59 6.35,15.99 6.35,10.5 PORTF.7
TMS
  Top 0.254: U1.4 15.4,23.05 12.55,23.05 5.74,16.24 5.74,12.43 PORTF.6

### Text on the board
tPlace: <=3.6V | GNDA | RX0 | GND | TX0 | XCK0 | ADC0 | ADC1 | ADC2 | ADC3 | XCK1 | ADC4 | TCK | TMS | ADC5 | TX1 | ADC6 | TDO | RX1 | ADC7 | TDI | Matt Wilkes r4 | GND | 1.8V | git.io/rfa1
bPlace: CLKI | GND | TST | RF